# EAGLE design Fake7501 (EAGLE 7.7.0)

## Sheet 1 of 3
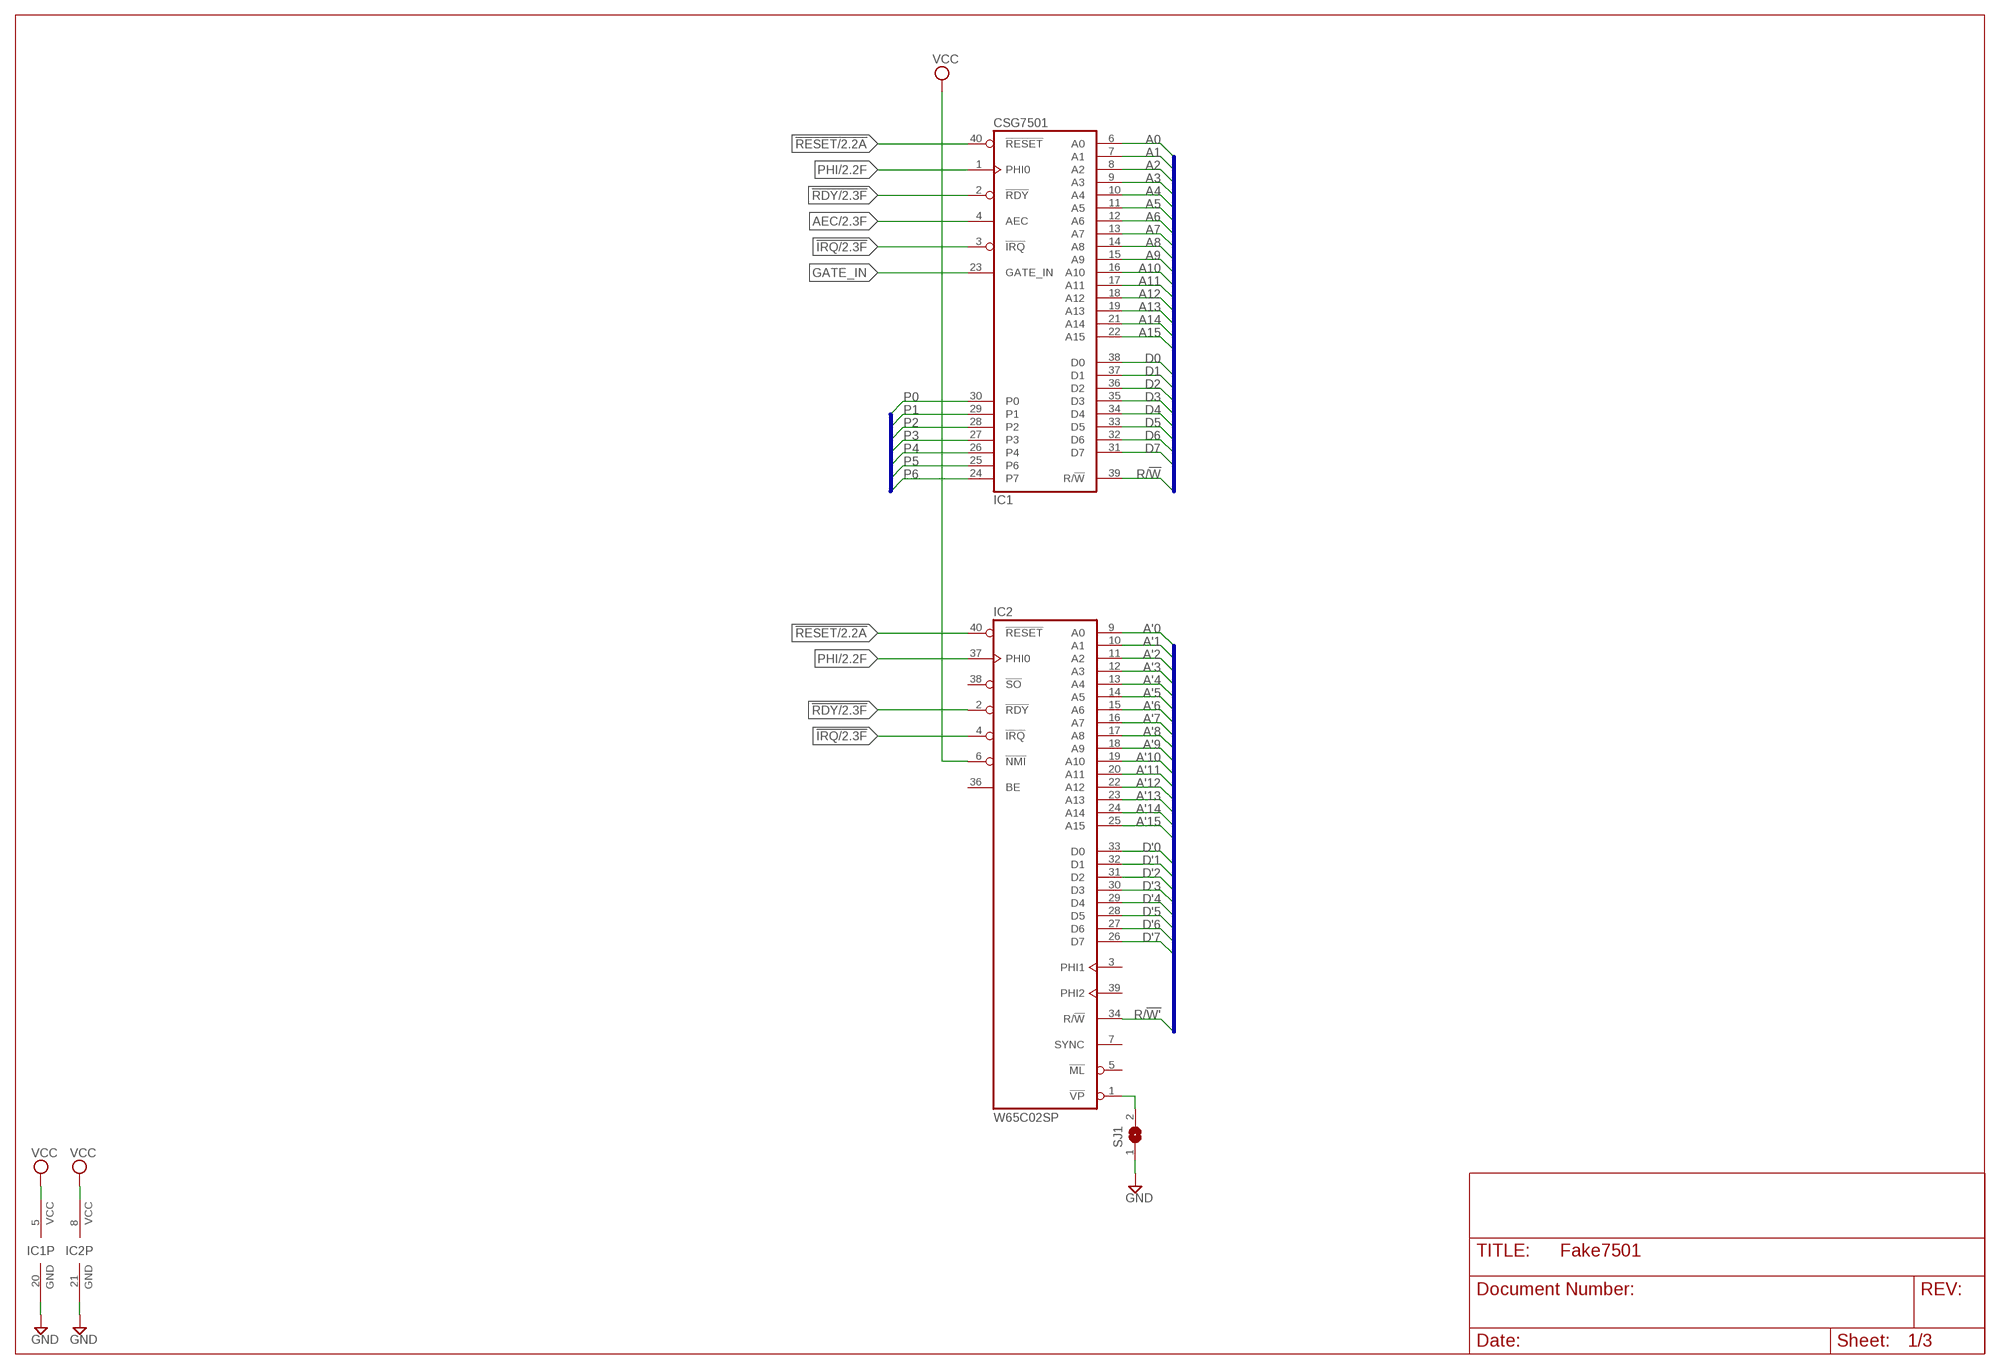
[diagram p0: schematic, sheet 1]

### Parts
IC1  CSG7501  7501-RP  [DIL40-ROUNDPAD]
IC2  W65C02SP  W65C02SP-R  [DIL40-ROUNDPAD]
SJ1  SJ  [SJ]

### Nets
!IRQ: IC1.3(!IRQ) IC2.4(!IRQ) ; also sheet 2
!RDY: IC1.2(!RDY) IC2.2(!RDY) ; also sheet 2
!RESET: IC1.40(!RESET) IC2.40(!RESET) ; also sheet 2
A0: IC1.6(A0) ; also sheet 2
A1: IC1.7(A1) ; also sheet 2
A2: IC1.8(A2) ; also sheet 2
A3: IC1.9(A3) ; also sheet 2
A4: IC1.10(A4) ; also sheet 2
A5: IC1.11(A5) ; also sheet 2
A6: IC1.12(A6) ; also sheet 2
A7: IC1.13(A7) ; also sheet 2
A8: IC1.14(A8) ; also sheet 2
A9: IC1.15(A9) ; also sheet 2
A10: IC1.16(A10) ; also sheet 2
A11: IC1.17(A11) ; also sheet 2
A12: IC1.18(A12) ; also sheet 2
A13: IC1.19(A13) ; also sheet 2
A14: IC1.21(A14) ; also sheet 2
A15: IC1.22(A15) ; also sheet 2
A'0: IC2.9(A0) ; also sheet 2
A'1: IC2.10(A1) ; also sheet 2
A'2: IC2.11(A2) ; also sheet 2
A'3: IC2.12(A3) ; also sheet 2
A'4: IC2.13(A4) ; also sheet 2
A'5: IC2.14(A5) ; also sheet 2
A'6: IC2.15(A6) ; also sheet 2
A'7: IC2.16(A7) ; also sheet 2
A'8: IC2.17(A8) ; also sheet 2
A'9: IC2.18(A9) ; also sheet 2
A'10: IC2.19(A10) ; also sheet 2
A'11: IC2.20(A11) ; also sheet 2
A'12: IC2.22(A12) ; also sheet 2
A'13: IC2.23(A13) ; also sheet 2
A'14: IC2.24(A14) ; also sheet 2
A'15: IC2.25(A15) ; also sheet 2
AEC: IC1.4(AEC) ; also sheet 2
D0: IC1.38(D0) ; also sheet 2
D1: IC1.37(D1) ; also sheet 2
D2: IC1.36(D2) ; also sheet 2
D3: IC1.35(D3) ; also sheet 2
D4: IC1.34(D4) ; also sheet 2
D5: IC1.33(D5) ; also sheet 2
D6: IC1.32(D6) ; also sheet 2
D7: IC1.31(D7) ; also sheet 2
D'0: IC2.33(D0) ; also sheet 2
D'1: IC2.32(D1) ; also sheet 2
D'2: IC2.31(D2) ; also sheet 2
D'3: IC2.30(D3) ; also sheet 2
D'4: IC2.29(D4) ; also sheet 2
D'5: IC2.28(D5) ; also sheet 2
D'6: IC2.27(D6) ; also sheet 2
D'7: IC2.26(D7) ; also sheet 2
GATE_IN: IC1.23(GATE_IN) ; also sheet 2
GND: IC1.20(GND) SJ1.1 ; also sheet 2,3
N$1: IC2.1(!VP) SJ1.2
P0: IC1.30(P0) ; also sheet 2
P1: IC1.29(P1) ; also sheet 2
P2: IC1.28(P2) ; also sheet 2
P3: IC1.27(P3) ; also sheet 2
P4: IC1.26(P4) ; also sheet 2
P5: IC1.25(P6) ; also sheet 2
P6: IC1.24(P7) ; also sheet 2
PHI: IC1.1(PHI0) IC2.37(PHI0) ; also sheet 2
R/!W: IC1.39(R/!W) ; also sheet 2
R/!W': IC2.34(R/!W) ; also sheet 2
VCC: IC1.5(VCC) IC2.6(!NMI) IC2.8(VCC) ; also sheet 3
Unconnected: IC2.3(PHI1) IC2.5(!ML) IC2.7(SYNC) IC2.36(BE) IC2.38(!SO) IC2.39(PHI2)

### Buses
R/!W',A'[0..15],D'[0..7]
A[0..15],D[0..7],R/!W
P[0..6]

## Sheet 2 of 3
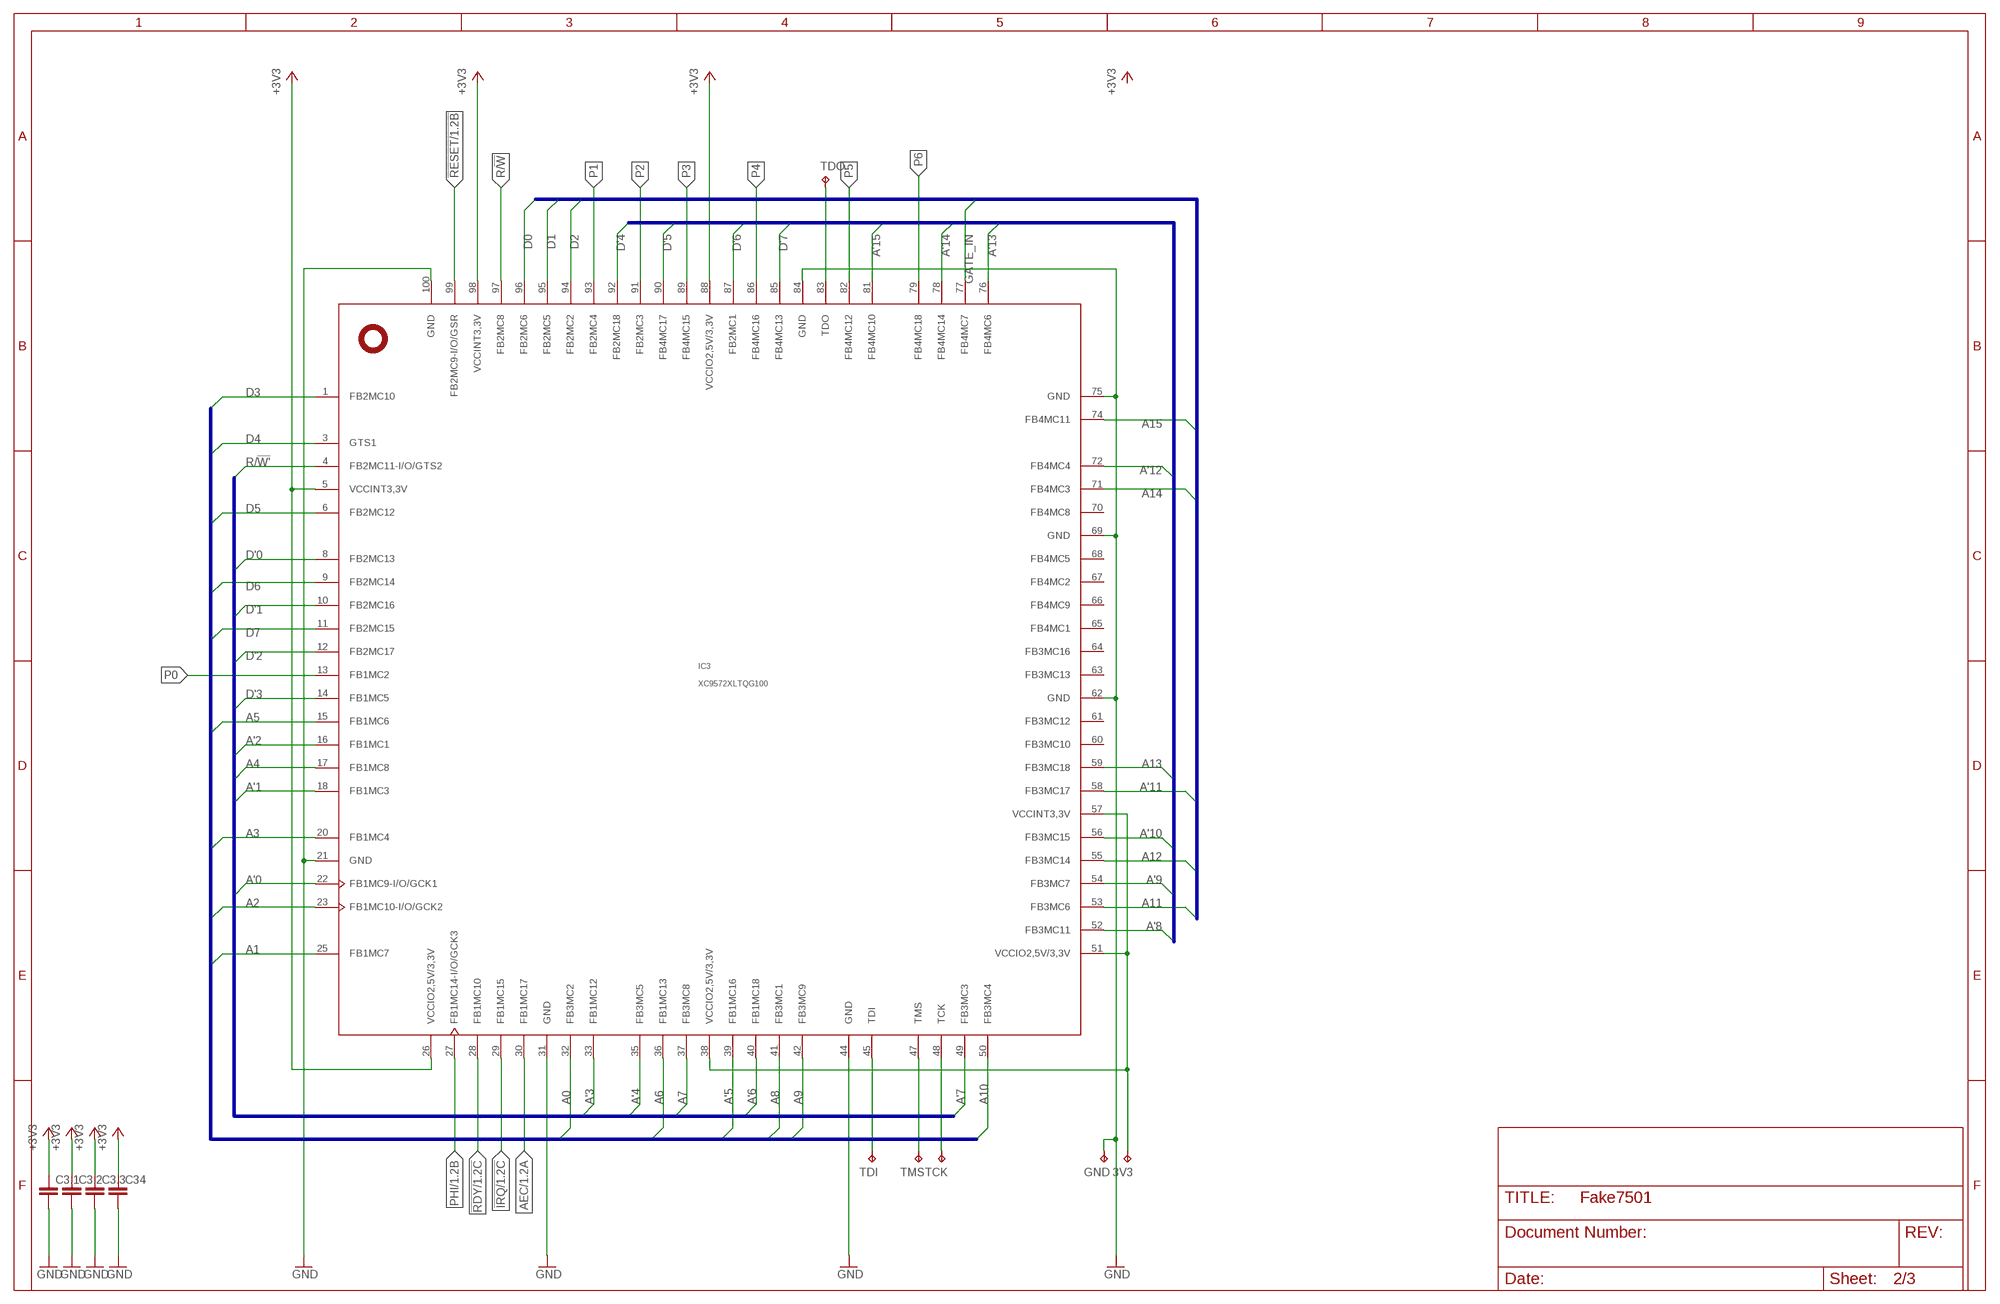
[diagram p1: schematic, sheet 2]

### Parts
3V3  TPTP10SQ  [TP10SQ]
C3.1  C-EUC0402  [C0402]
C3.2  C-EUC0402  [C0402]
C3.3  C-EUC0402  [C0402]
C34  C-EUC0402  [C0402]
GND  TPTP10SQ  [TP10SQ]
IC3  XC9572XLTQG100  [TQFP100]
TCK  TPTP10SQ  [TP10SQ]
TDI  TPTP10SQ  [TP10SQ]
TDO  TPTP10SQ  [TP10SQ]
TMS  TPTP10SQ  [TP10SQ]

### Nets
!IRQ: IC3.29(FB1MC15) ; also sheet 1
!RDY: IC3.28(FB1MC10) ; also sheet 1
!RESET: IC3.99(FB2MC9-I/O/GSR) ; also sheet 1
+3V3: 3V3.TP C3.1.1 C3.2.1 C3.3.1 C34.1 IC3.5(VCCINT3,3V) IC3.26(VCCIO2,5V/3,3V) IC3.38(VCCIO2,5V/3,3V) IC3.51(VCCIO2,5V/3,3V) IC3.57(VCCINT3,3V) IC3.88(VCCIO2,5V/3,3V) IC3.98(VCCINT3,3V) ; also sheet 3
A0: IC3.32(FB3MC2) ; also sheet 1
A1: IC3.25(FB1MC7) ; also sheet 1
A2: IC3.23(FB1MC10-I/O/GCK2) ; also sheet 1
A3: IC3.20(FB1MC4) ; also sheet 1
A4: IC3.17(FB1MC8) ; also sheet 1
A5: IC3.15(FB1MC6) ; also sheet 1
A6: IC3.35(FB3MC5) ; also sheet 1
A7: IC3.37(FB3MC8) ; also sheet 1
A8: IC3.40(FB1MC18) ; also sheet 1
A9: IC3.42(FB3MC9) ; also sheet 1
A10: IC3.50(FB3MC4) ; also sheet 1
A11: IC3.53(FB3MC6) ; also sheet 1
A12: IC3.55(FB3MC14) ; also sheet 1
A13: IC3.58(FB3MC17) ; also sheet 1
A14: IC3.71(FB4MC3) ; also sheet 1
A15: IC3.74(FB4MC11) ; also sheet 1
A'0: IC3.22(FB1MC9-I/O/GCK1) ; also sheet 1
A'1: IC3.18(FB1MC3) ; also sheet 1
A'2: IC3.16(FB1MC1) ; also sheet 1
A'3: IC3.33(FB1MC12) ; also sheet 1
A'4: IC3.36(FB1MC13) ; also sheet 1
A'5: IC3.39(FB1MC16) ; also sheet 1
A'6: IC3.41(FB3MC1) ; also sheet 1
A'7: IC3.49(FB3MC3) ; also sheet 1
A'8: IC3.52(FB3MC11) ; also sheet 1
A'9: IC3.54(FB3MC7) ; also sheet 1
A'10: IC3.56(FB3MC15) ; also sheet 1
A'11: IC3.59(FB3MC18) ; also sheet 1
A'12: IC3.72(FB4MC4) ; also sheet 1
A'13: IC3.76(FB4MC6) ; also sheet 1
A'14: IC3.78(FB4MC14) ; also sheet 1
A'15: IC3.81(FB4MC10) ; also sheet 1
AEC: IC3.30(FB1MC17) ; also sheet 1
D0: IC3.96(FB2MC6) ; also sheet 1
D1: IC3.95(FB2MC5) ; also sheet 1
D2: IC3.94(FB2MC2) ; also sheet 1
D3: IC3.1(FB2MC10) ; also sheet 1
D4: IC3.3(GTS1) ; also sheet 1
D5: IC3.6(FB2MC12) ; also sheet 1
D6: IC3.9(FB2MC14) ; also sheet 1
D7: IC3.11(FB2MC15) ; also sheet 1
D'0: IC3.8(FB2MC13) ; also sheet 1
D'1: IC3.10(FB2MC16) ; also sheet 1
D'2: IC3.12(FB2MC17) ; also sheet 1
D'3: IC3.14(FB1MC5) ; also sheet 1
D'4: IC3.92(FB2MC18) ; also sheet 1
D'5: IC3.90(FB4MC17) ; also sheet 1
D'6: IC3.87(FB2MC1) ; also sheet 1
D'7: IC3.85(FB4MC13) ; also sheet 1
GATE_IN: IC3.77(FB4MC7) ; also sheet 1
GND: C3.1.2 C3.2.2 C3.3.2 C34.2 GND.TP IC3.21(GND) IC3.31(GND) IC3.44(GND) IC3.62(GND) IC3.69(GND) IC3.75(GND) IC3.84(GND) IC3.100(GND) ; also sheet 1,3
N$3: IC3.48(TCK) TCK.TP
N$4: IC3.47(TMS) TMS.TP
N$5: IC3.45(TDI) TDI.TP
N$6: IC3.83(TDO) TDO.TP
P0: IC3.13(FB1MC2) ; also sheet 1
P1: IC3.93(FB2MC4) ; also sheet 1
P2: IC3.91(FB2MC3) ; also sheet 1
P3: IC3.89(FB4MC15) ; also sheet 1
P4: IC3.86(FB4MC16) ; also sheet 1
P5: IC3.82(FB4MC12) ; also sheet 1
P6: IC3.79(FB4MC18) ; also sheet 1
PHI: IC3.27(FB1MC14-I/O/GCK3) ; also sheet 1
R/!W: IC3.97(FB2MC8) ; also sheet 1
R/!W': IC3.4(FB2MC11-I/O/GTS2) ; also sheet 1
Unconnected: IC3.60(FB3MC10) IC3.61(FB3MC12) IC3.63(FB3MC13) IC3.64(FB3MC16) IC3.65(FB4MC1) IC3.66(FB4MC9) IC3.67(FB4MC2) IC3.68(FB4MC5) IC3.70(FB4MC8)

### Buses
A[0..15],D[0..7],R/!W
R/!W',A'[0..15],D'[0..7]

## Sheet 3 of 3
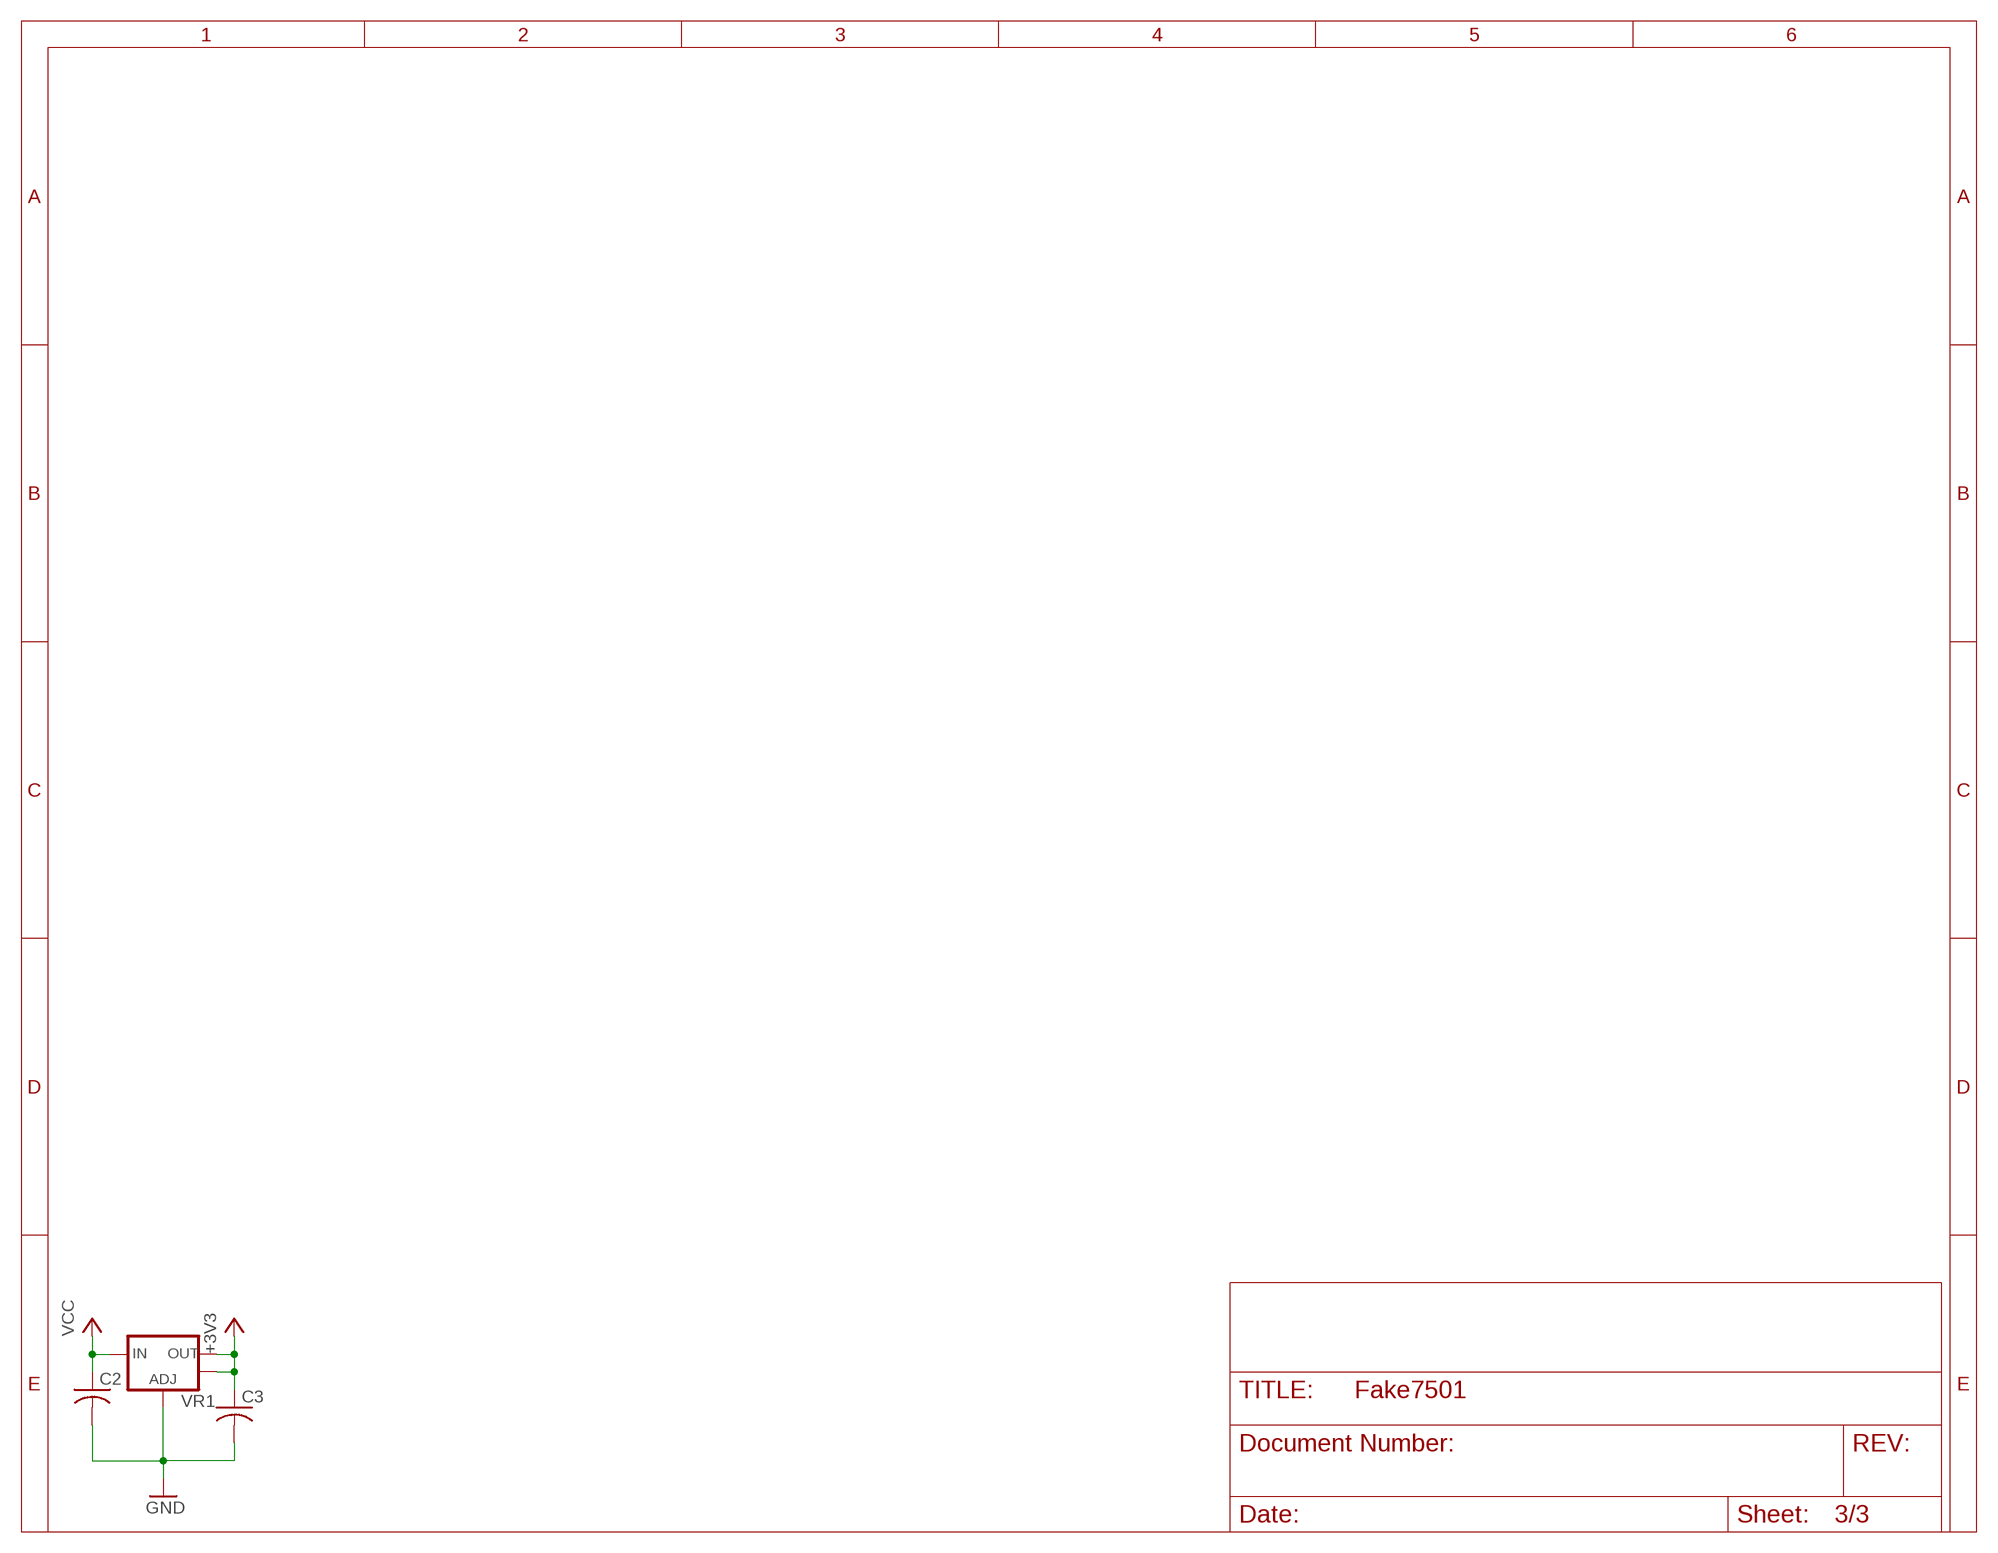
[diagram p2: schematic, sheet 3]

### Parts
C2  C-USC0805  [C0805]
C3  C-USC0805  [C0805]
VR1  V_REG_LM1117SOT223  [SOT223]

### Nets
+3V3: C3.1 VR1.2(OUT) VR1.4(OUT) ; also sheet 2
GND: C2.2 C3.2 VR1.1(ADJ) ; also sheet 1,2
VCC: C2.1 VR1.3(IN) ; also sheet 1

## Power pins joined to a net without a drawn wire
GND: IC2.21(GND)

## Library data of the parts
3V3 GND TCK TDI TDO TMS = testpad:TP: Test pad
C2 C3 = rcl:C-US: CAPACITOR, American symbol
C3.1-C3.3 C34 = rcl:C-EU: CAPACITOR, European symbol
IC1 = commodore:7501
IC2 = commodore:W65C02SP: Western Digital Version
IC3 = xilinx_xc95XXXxl:XC9572XLTQG100
SJ1 = jumper:SJ: SMD solder JUMPER
VR1 = SparkFun:V_REG_LM1117: Voltage Regulator LM1117 Standard adjustable voltage regulator but in SMD form. Spark Fun Electronics SKU : COM-00595

## Board
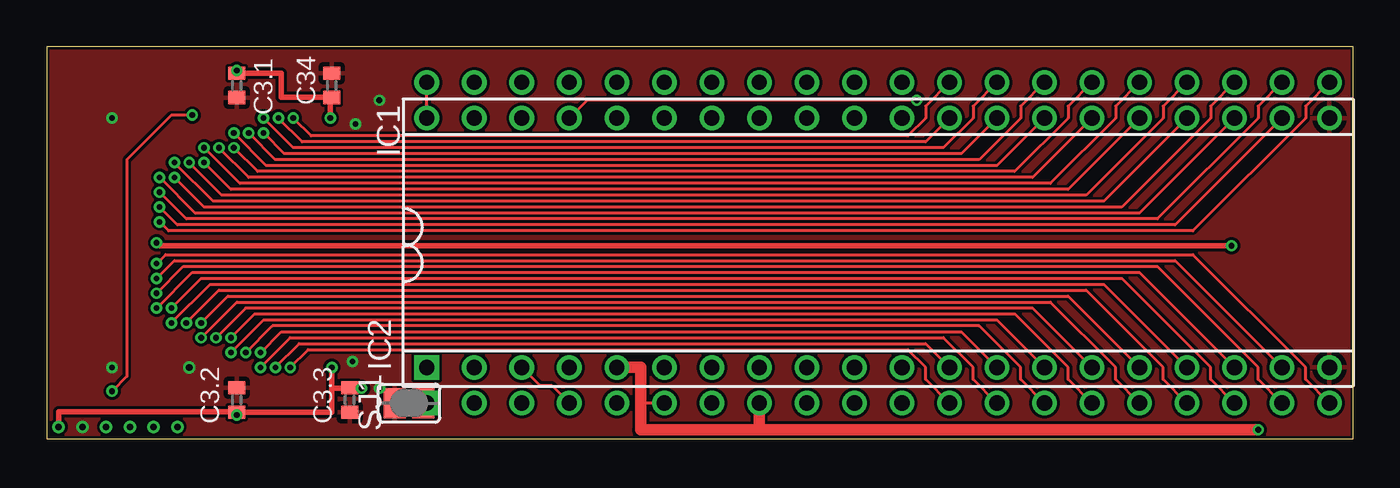
[diagram p3: board, top side]
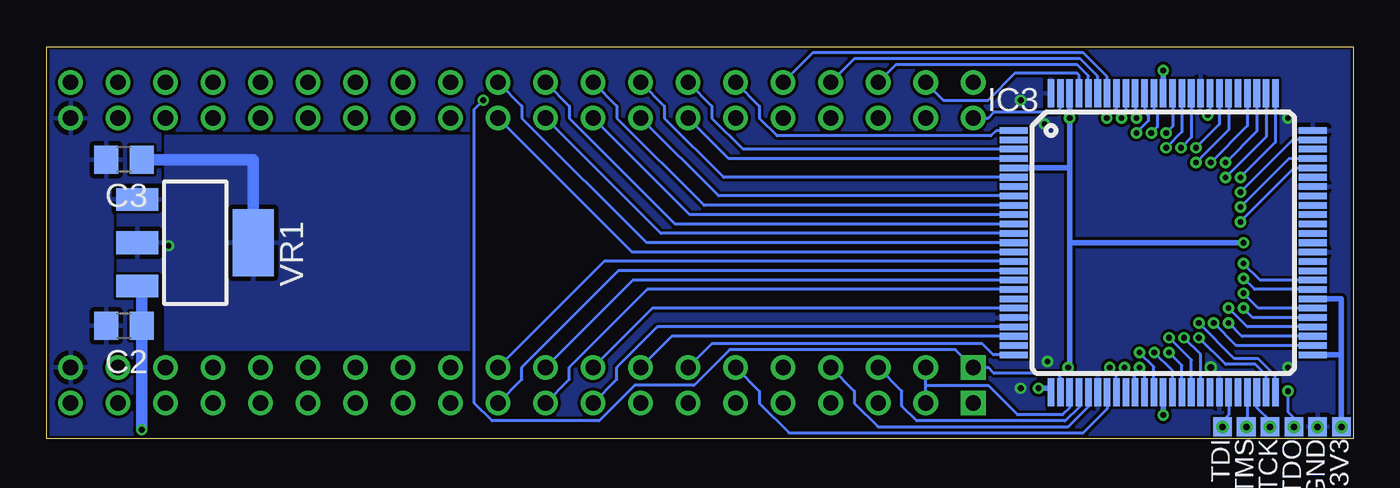
[diagram p4: board, bottom side, seen from below]

Size 69.85 x 20.95 mm. Coordinates in mm from the lower left corner, seen from the top.
Outline: 0,0 69.85,0 69.85,20.95 0,20.95 0,0
Copper layers (1*16): Top 0.035mm / dielectric 1.5mm / Bottom 0.035mm
Design rules "hackvana *": minimum track width 6mil, minimum drill 0.3mm, track to track 6mil, track to pad 6mil, pad to pad 6mil, via to via 6mil, smd to smd 0mil, copper to edge 6mil, drill to drill 6mil, minimum pad ring 10mil, minimum via ring 6mil, stop-mask expansion 2mil, vias tented up to drill 100mil, thermal gap 10mil

### Footprints (pad centres in the part's own frame; a part is rotated, then mirrored left to right if it is on the bottom)
TP10SQ = smd 1 x 1: TP 0,0
C0805 = smd 1.3 x 1.5: 1 -0.95,0; 2 0.95,0
C0402 = smd 0.7 x 0.9: 1 -0.65,0; 2 0.65,0
DIL40-ROUNDPAD = drill 0.813 square: 1 -24.13,-7.62 | drill 0.813: 2 -21.59,-7.62; 3 -19.05,-7.62; 4 -16.51,-7.62; 5 -13.97,-7.62; 6 -11.43,-7.62; 7 -8.89,-7.62; 8 -6.35,-7.62; 9 -3.81,-7.62; 10 -1.27,-7.62; 11 1.27,-7.62; 12 3.81,-7.62; 13 6.35,-7.62; 14 8.89,-7.62; 15 11.43,-7.62; 16 13.97,-7.62; 17 16.51,-7.62; 18 19.05,-7.62; 19 21.59,-7.62; 20 24.13,-7.62; 21 24.13,7.62; 22 21.59,7.62; 23 19.05,7.62; 24 16.51,7.62; 25 13.97,7.62; 26 11.43,7.62; 27 8.89,7.62; 28 6.35,7.62; 29 3.81,7.62; 30 1.27,7.62; 31 -1.27,7.62; 32 -3.81,7.62; 33 -6.35,7.62; 34 -8.89,7.62; 35 -11.43,7.62; 36 -13.97,7.62; 37 -16.51,7.62; 38 -19.05,7.62; 39 -21.59,7.62; 40 -24.13,7.62
TQFP100 = smd 1.5 x 0.35: 1 -8,6; 2 -8,5.5; 3 -8,5; 4 -8,4.5; 5 -8,4; 6 -8,3.5; 7 -8,3; 8 -8,2.5; 9 -8,2; 10 -8,1.5; 11 -8,1; 12 -8,0.5; 13 -8,0; 14 -8,-0.5; 15 -8,-1; 16 -8,-1.5; 17 -8,-2; 18 -8,-2.5; 19 -8,-3; 20 -8,-3.5; 21 -8,-4; 22 -8,-4.5; 23 -8,-5; 24 -8,-5.5; 25 -8,-6; 51 8,-6; 52 8,-5.5; 53 8,-5; 54 8,-4.5; 55 8,-4; 56 8,-3.5; 57 8,-3; 58 8,-2.5; 59 8,-2; 60 8,-1.5; 61 8,-1; 62 8,-0.5; 63 8,0; 64 8,0.5; 65 8,1; 66 8,1.5; 67 8,2; 68 8,2.5; 69 8,3; 70 8,3.5; 71 8,4; 72 8,4.5; 73 8,5; 74 8,5.5; 75 8,6 | smd 0.35 x 1.5: 26 -6,-8; 27 -5.5,-8; 28 -5,-8; 29 -4.5,-8; 30 -4,-8; 31 -3.5,-8; 32 -3,-8; 33 -2.5,-8; 34 -2,-8; 35 -1.5,-8; 36 -1,-8; 37 -0.5,-8; 38 0,-8; 39 0.5,-8; 40 1,-8; 41 1.5,-8; 42 2,-8; 43 2.5,-8; 44 3,-8; 45 3.5,-8; 46 4,-8; 47 4.5,-8; 48 5,-8; 49 5.5,-8; 50 6,-8; 76 6,8; 77 5.5,8; 78 5,8; 79 4.5,8; 80 4,8; 81 3.5,8; 82 3,8; 83 2.5,8; 84 2,8; 85 1.5,8; 86 1,8; 87 0.5,8; 88 0,8; 89 -0.5,8; 90 -1,8; 91 -1.5,8; 92 -2,8; 93 -2.5,8; 94 -3,8; 95 -3.5,8; 96 -4,8; 97 -4.5,8; 98 -5,8; 99 -5.5,8; 100 -6,8
SJ = smd 1.168 x 1.6: 1 -0.762,0; 2 0.762,0
SOT223 = smd 1.219 x 2.235: 1 -2.311,-3.099; 2 0,-3.099; 3 2.311,-3.099 | smd 3.6 x 2.2: 4 0,3.099

### Placement (x,y rotation side)
3V3  0.64,0.64 180 bottom
C2  65.72,6.03 180 bottom
C3  65.72,14.92 180 bottom
C3.1  10.16,18.89 270 top
C3.2  10.16,2.06 90 top
C3.3  16.19,2.06 270 top
C34  15.24,18.89 90 top
GND  1.91,0.64 180 bottom
IC1  44.45,11.43 0 top
IC2  44.45,9.53 0 top
IC3  10.16,10.48 0 bottom
SJ1  19.37,1.91 0 top
TCK  4.45,0.64 180 bottom
TDI  6.99,0.64 180 bottom
TDO  3.17,0.64 180 bottom
TMS  5.71,0.64 180 bottom
VR1  61.91,10.48 270 bottom

### Tracks (layer width: path | path; a pad name or v marks a point on that pad's centre or on a via)
!IRQ
  Top 0.152: IC1.3 26.35,2.86 26.99,2.86 IC2.4
  Bottom 0.152: IC3.29 14.66,1.69 15.4,0.95 23.34,0.95 24.13,1.75 24.13,2.54 IC1.3
!RDY
  Bottom 0.152: 22.86,2.86 19.53,2.86 17.94,1.27 15.56,1.27 15.16,1.67 IC3.28 | IC2.2 22.86,2.86 | 22.86,2.86 IC1.2
!RESET
  Top 0.152: IC2.40 IC1.40
  Bottom 0.152: IC2.40 19.53,17.14 19.21,17.46 15.88,17.46 15.66,17.68 IC3.99
+3V3  (via drill 0.3, 0.36)
  Top 0.305: v16.83,2.7 16.83,2.71 C3.3.1 16.19,2.7 15.24,2.7 | C3.1.1 v10.16,19.68 10.16,19.53 12.54,19.53 12.54,18.26 15.22,18.26 | v10.16,1.27 C3.2.1 | C3.2.1 15.24,1.41 15.24,2.7 | v15.24,3.81 15.24,2.7 | 15.24,18.26 15.22,18.26 | 3V3.TP 0.64,1.43 10.16,1.43 C3.2.1 | 15.22,18.26 C34.1 15.16,18.16 v15.16,17.14 | v63.34,10.32 6.03,10.32 v5.87,10.48
  Bottom 0.152: IC3.38 10.22,2.54
  Bottom 0.305: IC3.98 v15.16,17.14 15.16,14.48 | 15.16,14.48 IC3.5 | IC3.26 16.16,2.7 v16.83,2.7 | IC3.88 v10.16,19.68 | 15.16,14.48 15.16,10.48 | 15.16,10.48 15.16,3.81 v15.24,3.81 | IC3.51 0.64,4.48 | 0.64,4.48 0.64,7.48 IC3.57 | 3V3.TP 0.64,4.48 | v5.87,10.48 15.16,10.48 | IC3.38 v10.16,1.27
  Bottom 0.61: C3.1 58.81,14.92 VR1.4
  other vias: 0.64,0.64
  pour Bottom: 66.04,8.89 66.04,12.06 63.5,12.06 63.5,16.19 46.99,16.19 46.99,4.76 63.5,4.76 63.5,8.89
A0
  Bottom 0.152: IC1.6 31.75,2.54 31.75,1.91 30.16,0.32 14.45,0.32 13.16,1.6 IC3.32
A1
  Bottom 0.152: IC3.25 19.24,4.48 19.84,5.08 34.29,5.08 IC1.7
A2
  Bottom 0.152: IC3.23 36.43,5.48 IC1.8
A3
  Bottom 0.152: IC3.20 37.47,6.98 IC1.9
A4
  Bottom 0.152: IC3.17 38.51,8.48 IC1.10
A5
  Bottom 0.152: IC3.15 40.05,9.48 IC1.11
A6  (via drill 0.3)
  Top 0.152: v12.22,3.81 13.49,5.08 46.99,5.08 IC1.12
  Bottom 0.152: IC3.35 11.66,3.25 v12.22,3.81
A7  (via drill 0.3)
  Top 0.152: v11.43,4.6 12.54,5.71 48.9,5.71 IC1.13
  Bottom 0.152: IC3.37 10.66,3.83 v11.43,4.6
A8  (via drill 0.3)
  Top 0.152: v9.84,4.6 11.59,6.35 50.8,6.35 IC1.14
  Bottom 0.152: IC3.40 9.16,3.92 v9.84,4.6
A9  (via drill 0.3)
  Top 0.152: v9.05,5.4 10.64,6.99 52.7,6.99 IC1.15
  Bottom 0.152: IC3.42 8.16,4.51 v9.05,5.4
A10  (via drill 0.3)
  Top 0.152: v8.26,6.19 9.68,7.62 54.61,7.62 IC1.16
  Bottom 0.152: IC3.50 4.16,3.37 5.08,4.29 6.35,4.29 v8.26,6.19
A11  (via drill 0.3)
  Top 0.152: v6.67,6.19 8.73,8.26 56.52,8.26 IC1.17
  Bottom 0.152: IC3.53 5.95,5.48 v6.67,6.19
A12  (via drill 0.3)
  Top 0.152: v5.87,6.99 7.78,8.89 58.42,8.89 IC1.18
  Bottom 0.152: IC3.55 5.37,6.48 v5.87,6.99
A13  (via drill 0.3)
  Top 0.152: v5.87,8.57 6.83,9.53 60.33,9.53 IC1.19
  Bottom 0.152: IC3.58 5.28,7.98 v5.87,8.57
A14  (via drill 0.3)
  Top 0.152: IC1.21 67.31,17.78 67.31,17.14 61.28,11.11 6.51,11.11 v6.03,11.59
  Bottom 0.152: v6.03,11.59 3.14,14.48 IC3.71
A15  (via drill 0.3)
  Top 0.152: v6.03,13.18 7.46,11.75 59.37,11.75 64.77,17.14 64.77,17.78 IC1.22
  Bottom 0.152: IC3.74 3.23,15.98 v6.03,13.18
A'0
  Bottom 0.152: IC2.9 39.37,3.17 39.37,3.81 37.2,5.98 IC3.22
A'1
  Bottom 0.152: IC2.10 41.91,3.17 41.91,3.81 37.74,7.98 IC3.18
A'2
  Bottom 0.152: IC2.11 44.45,3.17 44.45,3.81 39.28,8.98 IC3.16
A'3  (via drill 0.3)
  Top 0.152: IC2.12 46.99,3.17 46.99,3.81 46.04,4.76 13.97,4.76 v13.02,3.81
  Bottom 0.152: IC3.33 12.66,3.45 v13.02,3.81
A'4  (via drill 0.3)
  Top 0.152: IC2.13 49.53,3.17 49.53,3.81 47.94,5.4 13.02,5.4 v11.43,3.81
  Bottom 0.152: IC3.36 11.16,3.54 v11.43,3.81
A'5  (via drill 0.3)
  Top 0.152: IC2.14 52.07,3.17 52.07,3.81 49.85,6.03 12.06,6.03 v10.64,4.6
  Bottom 0.152: IC3.39 9.66,3.63 v10.64,4.6
A'6  (via drill 0.3)
  Top 0.152: IC2.15 54.61,3.17 54.61,3.81 51.75,6.67 11.11,6.67 v9.84,5.4
  Bottom 0.152: IC3.41 8.66,4.21 v9.84,5.4
A'7  (via drill 0.3)
  Top 0.152: IC2.16 57.15,3.17 57.15,3.81 53.66,7.3 10.16,7.3 v8.26,5.4
  Bottom 0.152: IC3.49 4.66,3.39 5.24,3.97 6.83,3.97 v8.26,5.4
A'8  (via drill 0.3)
  Top 0.152: IC2.17 59.69,3.17 59.69,3.81 55.56,7.94 9.21,7.94 v7.46,6.19
  Bottom 0.152: IC3.52 6.25,4.98 v7.46,6.19
A'9  (via drill 0.3)
  Top 0.152: IC2.18 62.23,3.17 62.23,3.81 57.47,8.57 8.26,8.57 v6.67,6.99
  Bottom 0.152: IC3.54 5.66,5.98 v6.67,6.99
A'10  (via drill 0.3)
  Top 0.152: IC2.19 64.77,3.17 64.77,3.81 59.37,9.21 7.3,9.21 v5.87,7.78
  Bottom 0.152: IC3.56 5.07,6.98 v5.87,7.78
A'11  (via drill 0.3)
  Top 0.152: IC2.20 67.31,3.17 67.31,3.81 61.28,9.84 6.35,9.84 v5.87,9.37
  Bottom 0.152: IC3.59 4.99,8.48 v5.87,9.37
A'12  (via drill 0.3)
  Top 0.152: IC2.22 60.33,11.43 6.99,11.43 v6.03,12.38
  Bottom 0.152: IC3.72 3.44,14.98 v6.03,12.38
A'13  (via drill 0.3)
  Top 0.152: IC2.23 58.42,12.06 7.94,12.06 v6.03,13.97
  Bottom 0.152: IC3.76 4.16,15.84 v6.03,13.97
A'14  (via drill 0.3)
  Top 0.152: IC2.24 56.52,12.7 8.89,12.7 v6.83,14.76
  Bottom 0.152: IC3.78 5.16,16.43 v6.83,14.76
A'15  (via drill 0.3)
  Top 0.152: IC2.25 54.61,13.34 9.84,13.34 v8.41,14.76
  Bottom 0.152: IC3.81 6.66,16.52 v8.41,14.76
AEC
  Bottom 0.152: IC1.4 26.67,2.54 26.67,1.91 25.4,0.64 15.24,0.64 14.16,1.72 IC3.30
D0
  Bottom 0.152: IC1.38 24.45,20 14.76,20 14.16,19.4 IC3.96
D1
  Bottom 0.152: IC1.37 26.67,20.32 14.61,20.32 13.66,19.38 IC3.95
D2
  Bottom 0.152: IC1.36 28.89,20.64 14.45,20.64 13.16,19.35 IC3.94
D3
  Bottom 0.152: IC1.35 31.75,17.78 31.75,17.14 30.8,16.19 19.37,16.19 19.08,16.48 IC3.1
D4
  Bottom 0.152: IC1.34 34.29,17.78 34.29,17.14 32.62,15.48 IC3.3
D5
  Bottom 0.152: IC1.33 36.83,17.78 36.83,17.14 33.66,13.98 IC3.6
D6
  Bottom 0.152: IC1.32 39.37,17.78 39.37,17.14 34.7,12.48 IC3.9
D7
  Bottom 0.152: IC1.31 41.91,17.78 41.91,17.14 36.24,11.48 IC3.11
D'0
  Bottom 0.152: IC2.33 33.93,12.98 IC3.8
D'1
  Bottom 0.152: IC2.32 35.47,11.98 IC3.10
D'2
  Bottom 0.152: IC2.31 37.01,10.98 IC3.12
D'3
  Bottom 0.152: IC3.14 38.55,9.98 IC2.30
D'4  (via drill 0.3)
  Top 0.152: IC2.29 46.99,15.88 13.65,15.88 v12.38,17.14
  Bottom 0.152: IC3.92 12.16,17.37 v12.38,17.14
D'5  (via drill 0.3)
  Top 0.152: IC2.28 48.9,15.24 12.7,15.24 v11.59,16.35
  Bottom 0.152: IC3.90 11.16,17.51 10.95,17.3 10.95,16.99 v11.59,16.35
D'6  (via drill 0.3)
  Top 0.152: IC2.27 50.8,14.61 11.75,14.61 v10,16.35
  Bottom 0.152: IC3.87 9.66,16.69 v10,16.35
D'7  (via drill 0.3)
  Top 0.152: IC2.26 52.7,13.97 10.79,13.97 v9.21,15.56
  Bottom 0.152: IC3.85 8.66,16.11 v9.21,15.56
GATE_IN  (via drill 0.3)
  Top 0.152: v6.83,13.97 8.41,12.38 57.47,12.38 62.23,17.14 62.23,17.78 IC1.23
  Bottom 0.152: IC3.77 4.66,16.14 v6.83,13.97
GND  (via drill 0.3, 0.36)
  other vias: 3.49,17.14 16.51,16.83 17.78,18.1 3.49,3.81 16.35,4.13 17.78,2.7 1.91,0.64 7.62,3.81
  pour Bottom (rank 2): 0,20.95 69.85,20.95 69.85,0 0,0
  pour Top: 0,20.95 69.85,20.95 69.85,0 0,0
N$1
  Top 0.152: SJ1.2 IC2.1
N$3  (via drill 0.36)
  Bottom 0.152: IC3.48 5.16,1.67 4.45,0.95 TCK.TP
  other vias: 4.45,0.64
N$4  (via drill 0.36)
  Bottom 0.152: IC3.47 5.66,1.17 5.71,1.11 TMS.TP
  other vias: 5.71,0.64
N$5  (via drill 0.36)
  Bottom 0.152: IC3.45 6.66,1.28 6.99,0.95 TDI.TP
  other vias: 6.99,0.64
N$6  (via drill 0.3, 0.36)
  Top 0.152: v7.78,17.3 6.67,17.3 4.29,14.92 4.29,3.33 v3.49,2.54
  Bottom 0.152: IC3.83 7.66,17.42 v7.78,17.3 | v3.49,2.54 3.49,1.43 3.17,1.11 TDO.TP
  other vias: 3.17,0.64
P0
  Bottom 0.152: IC1.30 44.45,17.78 44.45,17.14 37.78,10.48 IC3.13
P1  (via drill 0.3)
  Top 0.152: IC1.29 46.99,17.78 46.99,17.14 46.04,16.19 14.13,16.19 v13.18,17.14
  Bottom 0.152: IC3.93 12.66,17.66 v13.18,17.14
P2  (via drill 0.3)
  Top 0.152: IC1.28 49.53,17.78 49.53,17.14 47.94,15.56 13.18,15.56 v11.59,17.14
  Bottom 0.152: IC3.91 11.66,17.22 v11.59,17.14
P3  (via drill 0.3)
  Top 0.152: IC1.27 52.07,17.78 52.07,17.14 49.85,14.92 12.22,14.92 v10.79,16.35
  Bottom 0.152: IC3.89 10.66,17.64 10.48,17.46 10.48,16.67 v10.79,16.35
P4  (via drill 0.3)
  Top 0.152: IC1.26 54.61,17.78 54.61,17.14 51.75,14.29 11.27,14.29 v10,15.56
  Bottom 0.152: IC3.86 9.16,16.4 v10,15.56
P5  (via drill 0.3)
  Top 0.152: IC1.25 57.15,17.78 57.15,17.14 53.66,13.65 10.32,13.65 v8.41,15.56
  Bottom 0.152: IC3.82 7.16,16.81 v8.41,15.56
P6  (via drill 0.3)
  Top 0.152: IC1.24 59.69,17.78 59.69,17.14 55.56,13.02 9.37,13.02 v7.62,14.76
  Bottom 0.152: IC3.79 5.66,16.72 v7.62,14.76
PHI  (via drill 0.3)
  Top 0.152: v46.51,18.1 28.89,18.1 IC2.37
  Bottom 0.152: IC3.27 15.66,3.28 15.88,3.49 19.21,3.49 19.53,3.81 IC1.1 21.27,4.76 33.34,4.76 35.24,2.86 38.42,2.86 40.32,0.95 46.04,0.95 46.99,1.91 46.99,17.62 v46.51,18.1
R/!W
  Bottom 0.152: IC1.39 21.91,18.1 19.53,18.1 18.1,19.53 14.76,19.53 14.66,19.42 IC3.97
R/!W'
  Bottom 0.152: IC2.34 33.39,14.98 IC3.4
VCC  (via drill 0.3)
  Top 0.152: IC2.6 31.75,1.91
  Top 0.61: 38.1,0.48 31.75,0.48 31.75,1.91 31.75,3.81 IC1.5 | 38.1,0.48 IC2.8 | v64.77,0.48 38.1,0.48
  Bottom 0.61: v64.77,0.48 C2.1 64.77,8.17 VR1.3